# Altium schematic sheet STM32_M95.SchDoc
size C
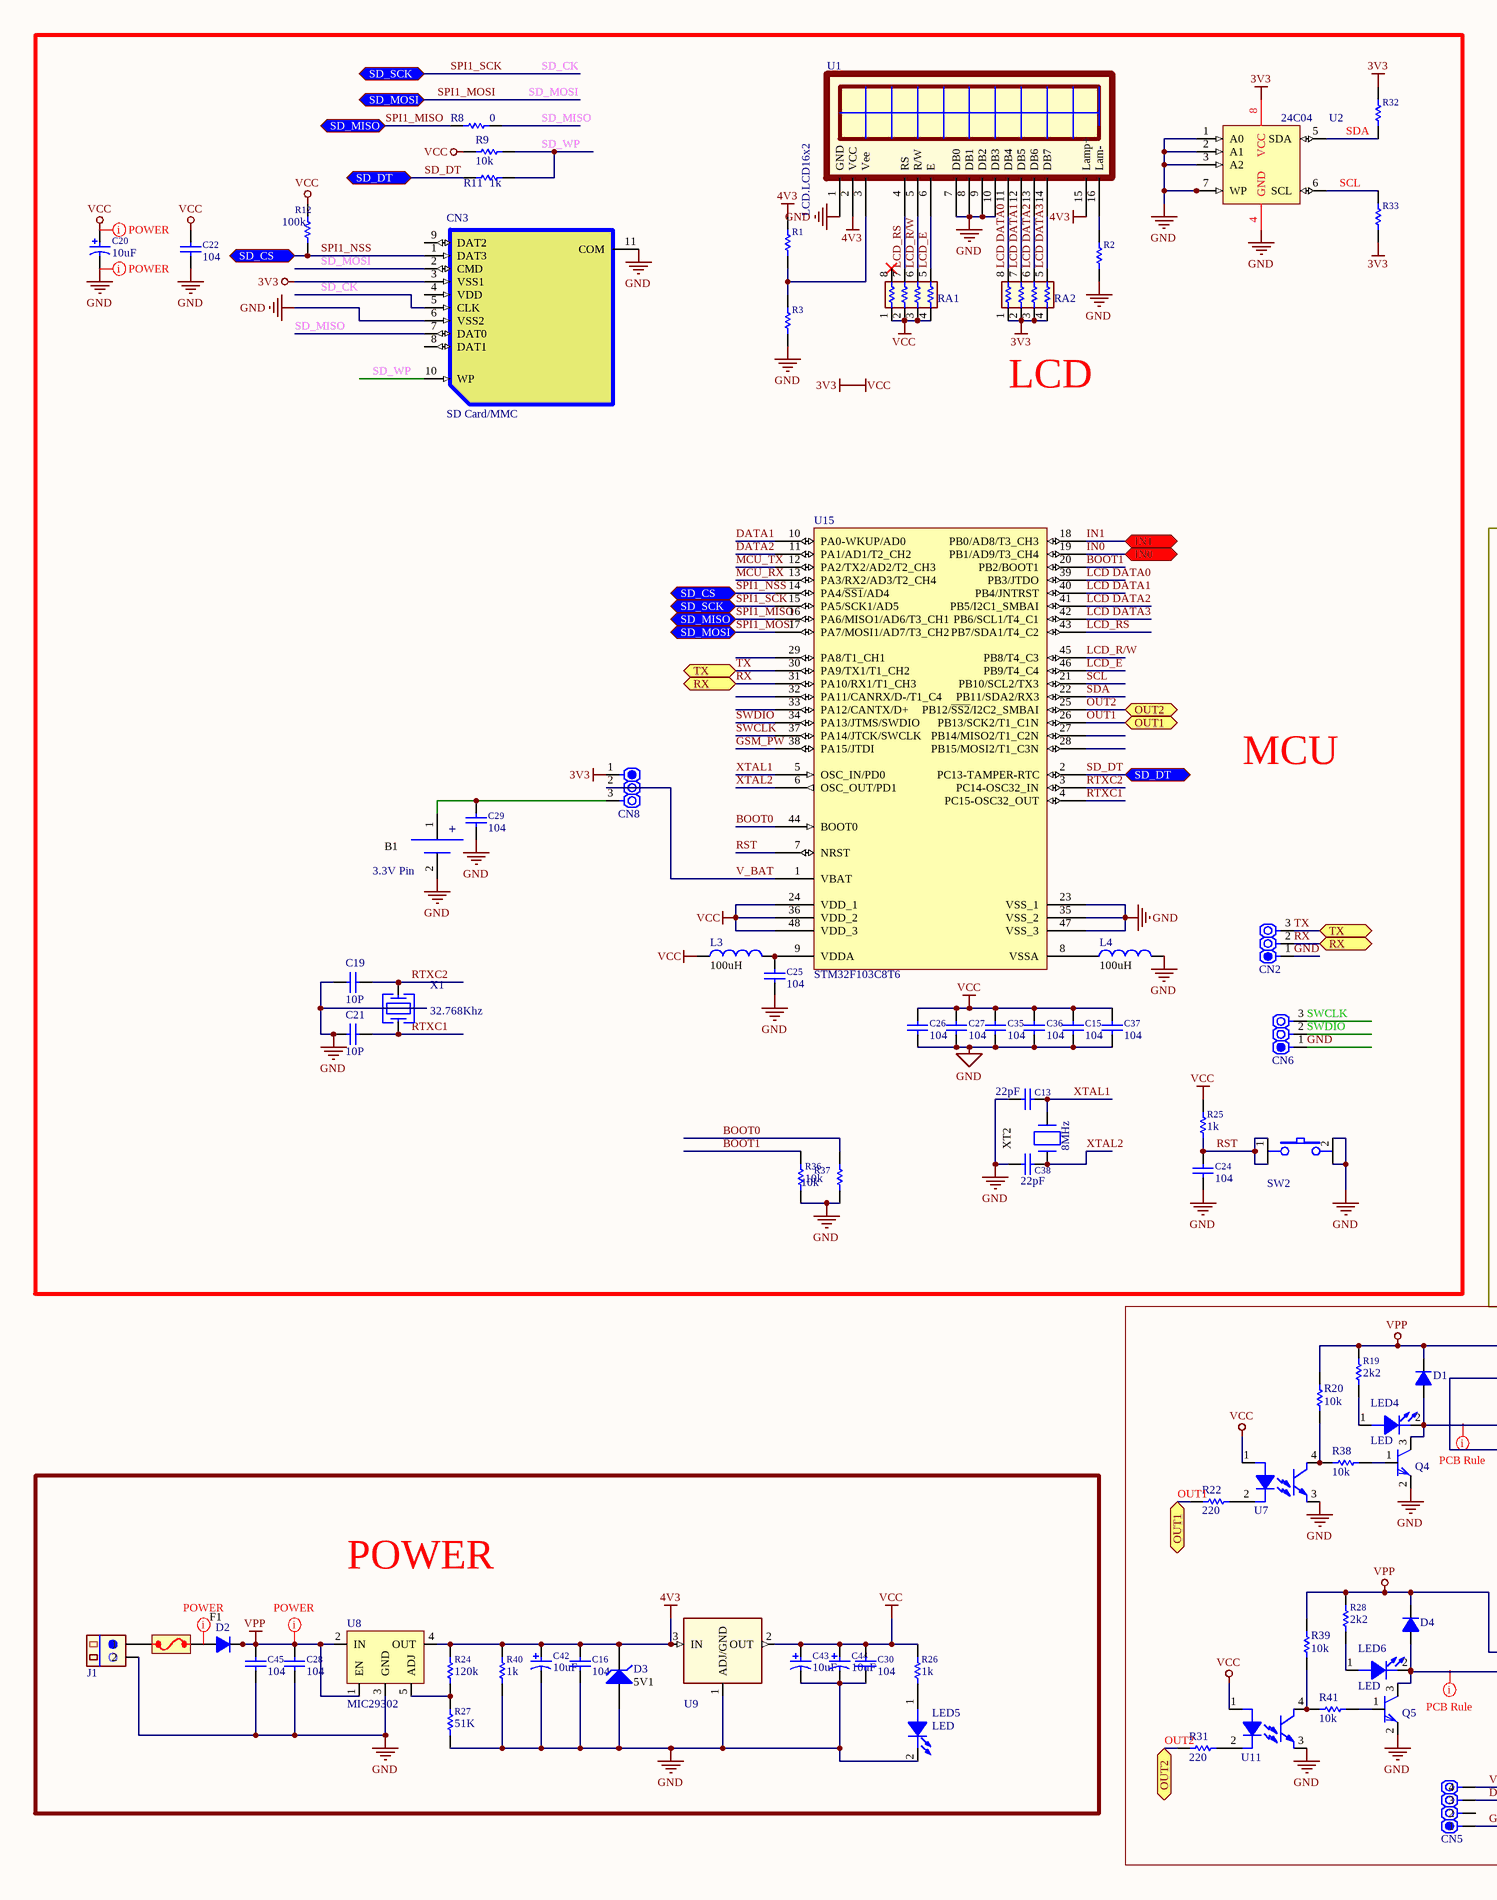
[diagram p0: STM32_M95.SchDoc, left]
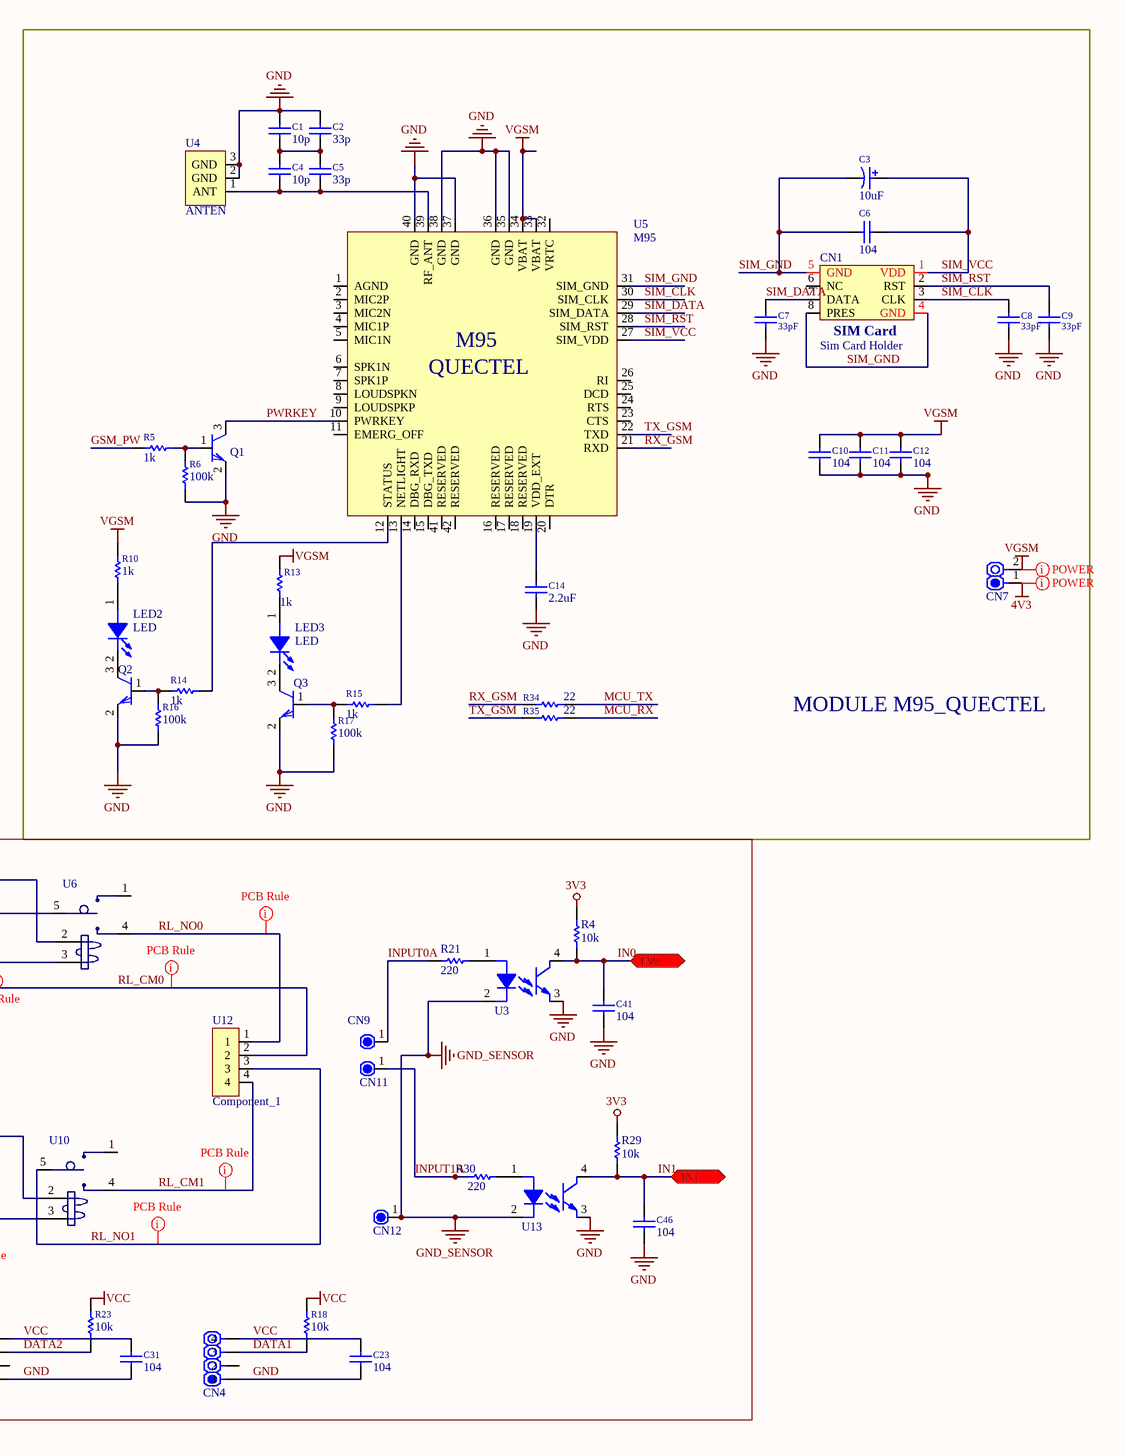
[diagram p1: STM32_M95.SchDoc, right]

## Parts
B1  value 3.3V Pin  [Batt_small]  (hidden comment: BATT-Holder)
C1  10p  [C2012-0805]
C2  33p  [C2012-0805]
C3  10uF  [Cap SMD Tant 10u]
C4  10p  [C2012-0805]
C5  33p  [C2012-0805]
C6  104  [C1608-0603]
C7  33pF  [C1608-0603]
C8  33pF  [C1608-0603]
C9  33pF  [C1608-0603]
C10  104  [C2012-0805]
C11  104  [C2012-0805]
C12  104  [C2012-0805]
C13  22pF  [C2012-0805]
C14  2.2uF  [C1206]
C15  104  [C2012-0805]
C16  104  [C1608-0603]
C19  10P  [C2012-0805]
C20  10uF  [Cap SMD Tant 10u]
C21  10P  [C2012-0805]
C22  104  [C2012-0805]
C23  104  [C1608-0603]
C24  104  [C2012-0805]
C25  104  [C2012-0805]
C26  104  [C2012-0805]
C27  104  [C2012-0805]
C28  104  [C1608-0603]
C29  104  [R1608-0603]
C30  104  [C1608-0603]
C31  104  [C1608-0603]
C35  104  [C2012-0805]
C36  104  [C2012-0805]
C37  104  [C2012-0805]
C38  22pF  [C2012-0805]
C41  104  [C1608-0603]
C42  10uF  [Cap SMD Tant - 470u]
C43  10uF  [Cap SMD Tant 10u]
C44  10uF  [Cap SMD Tant 10u]
C45  104  [C1210]
C46  104  [C1608-0603]
CN1  Sim Card Holder  [Sim card holder 1]
CN2  HDR1x3  [CON.HDR1X3]  (value not drawn)
CN3  SD Card/MMC  [mini_SDCard]
CN4  HDR1x4  [CON.HDR1X4]  (value not drawn)
CN5  HDR1x4  [CON.HDR1X4]  (value not drawn)
CN6  HDR1x3  [CON.HDR1X3]  (value not drawn)
CN7  HDR1x2  [CON.HDR1X2]  (value not drawn)
CN8  HDR1x3  [CON.HDR1X3]  (value not drawn)
CN9  HDR1  [CON.HDR1]  (value not drawn)
CN11  HDR1  [CON.HDR1]  (value not drawn)
CN12  HDR1  [CON.HDR1]  (value not drawn)
D1  FR307  [FR307]  (value not drawn)
D2  1N4007  [DO-214AA,SMB]  (value not drawn)
D3  value 5V1  [D1208]  (hidden comment: Zener)
D4  FR307  [FR307]  (value not drawn)
F1  FUSE  [FUSE.SMD2010]  (value not drawn)
J1  Domino2  [Domino 2 - Thao roi]  (value not drawn)
L3  100uH  [L2012-0805]
L4  100uH  [L2012-0805]
LED2  LED  [LED.SMD0805]
LED3  LED  [LED.SMD0805]
LED4  LED  [LED.SMD0805]
LED5  LED  [LED.SMD0805]
LED6  LED  [LED.SMD0805]
Q1  C1815  [SOT23 [C1815]]  (value not drawn)
Q2  C1815  [SOT23 [C1815]]  (value not drawn)
Q3  C1815  [SOT23 [C1815]]  (value not drawn)
Q4  C1815  [SOT23 [C1815]]  (value not drawn)
Q5  C1815  [SOT23 [C1815]]  (value not drawn)
R1  (no value)  [R2012-0805]
R2  (no value)  [R2012-0805]
R3  (no value)  [R2012-0805]
R4  10k  [R1608-0603]
R5  1k  [R1608-0603]
R6  100k  [R1608-0603]
R8  0  [R2012-0805]
R9  10k  [R2012-0805]
R10  1k  [R1608-0603]
R11  1k  [R2012-0805]
R12  100k  [R2012-0805]
R13  1k  [R1608-0603]
R14  1k  [R1608-0603]
R15  1k  [R1608-0603]
R16  100k  [R1608-0603]
R17  100k  [R1608-0603]
R18  10k  [R2012-0805]
R19  2k2  [R2012-0805]
R20  10k  [R1608-0603]
R21  220  [R1608-0603]
R22  220  [R2012-0805]
R23  10k  [R2012-0805]
R24  120k  [R1608-0603]
R25  1k  [R2012-0805]
R26  1k  [R1608-0603]
R27  51K  [R1608-0603]
R28  2k2  [R2012-0805]
R29  10k  [R1608-0603]
R30  220  [R1608-0603]
R31  220  [R2012-0805]
R32  (no value)  [R2012-0805]
R33  (no value)  [R2012-0805]
R34  22  [R1608-0603]
R35  22  [R1608-0603]
R36  10k  [R1608-0603]
R37  10k  [R1608-0603]
R38  10k  [R1608-0603]
R39  10k  [R1608-0603]
R40  1k  [R1608-0603]
R41  10k  [R1608-0603]
RA1  10,100,1K,10K  [Res_Array_Chip]  (value not drawn)
RA2  10,100,1K,10K  [Res_Array_Chip]  (value not drawn)
SW2  SW TACT-SPST-2  [BUTTON_RIGHT_ANGLE]  (value not drawn)
U1  LCD.LCD16x2  [LCD connector]
U2  24C04  [SOIC8]
U3  PC817  [DIP4]  (value not drawn)
U4  ANTEN  [SOT150P320X110-3N]
U5  M95  [QFN50P400X400X80_HS-15N]
U6  RELAY_OMRON_4PIN  [PCBComponent_1]  (value not drawn)
U7  PC817  [DIP4]  (value not drawn)
U8  MIC29302  [DPAK165P1524X238-5N]
U9  LM1117-3.3V  [TO-252]  (value not drawn)
U10  RELAY_OMRON_4PIN  [PCBComponent_1]  (value not drawn)
U11  PC817  [DIP4]  (value not drawn)
U12  Component_1  [PCBComponent_1]
U13  PC817  [DIP4]  (value not drawn)
U15  STM32F103C8T6  [QFP48_pitch_0.5mm]
X1  32.768Khz  [Crystal cylinder]
XT2  8MHz  [QC49/SMD]

## Blocks framed on the sheet
MODULE M95_QUECTEL: C1-C12 C14 CN1 CN7 LED2 LED3 Q1-Q3 R5 R6 R10 R13-R17 R34 R35 U4 U5
POWER: C16 C28 C30 C42-C45 D2 D3 F1 J1 LED5 R24 R26 R27 R40 U8 U9

## Ports
IN0, IN1, OUT1, OUT2, RX, SD_CS, SD_DT, SD_MISO, SD_MOSI, SD_SCK, TX

## Nets
4V3: C16.1 C42.1 CN7.1 D3.2(K) R1.1 R24.1 R40.1 U1.2(VCC) U1.15(Lamp+) U8.4(OUT) U9.3(IN)
GND: B1.2(-) C1.1 C2.1 C7.2 C8.2 C9.2 C10.2 C11.2 C12.2 C13.1 C14.2 C15.2 C16.2 C19.1 C20.2 C21.1 C22.2 C23.2 C24.2 C25.2 C26.2 C27.2 C28.2 C29.2 C30.2 C31.2 C35.2 C36.2 C37.2 C38.1 C41.2 C42.2 C43.2 C44.2 C45.2 C46.2 CN2.1 CN3.6(VSS2) CN3.11(COM) CN4.1 CN5.1 CN6.1 D3.1(A) J1.2 L4.2 LED5.2(K) Q1.2(E) Q2.2(E) Q3.2(E) Q4.2(E) Q5.2(E) R2.2 R3.2 R6.1 R16.1 R17.2 R27.2 R36.2 R37.2 R40.2 SW2.2 U1.1(GND) U1.7(DB0) U1.8(DB1) U1.9(DB2) U1.10(DB3) U2.1(A0) U2.2(A1) U2.3(A2) U2.4(GND) U2.7(WP) U3.3 U4.2(GND) U4.3(GND) U5.35(GND) U5.36(GND) U5.37(GND) U5.38(GND) U5.40(GND) U7.3 U8.3(GND) U9.1(ADJ/GND) U11.3 U13.3 U15.23(VSS_1) U15.35(VSS_2) U15.47(VSS_3) X1.3(GND)
GND_SENSOR: CN12.1 U3.2 U13.2
VCC: C15.1 C20.1 C22.1 C23.1 C26.1 C27.1 C30.1 C31.1 C35.1 C36.1 C37.1 C43.1 C44.1 CN3.3(VSS1) CN4.4 CN5.4 CN8.1 L3.1 R4.2 R9.1 R12.1 R18.1 R23.1 R25.1 R26.1 R29.2 R32.1 R33.2 RA1.1 RA1.2 RA1.3 RA1.4 RA2.1 RA2.2 RA2.3 RA2.4 U2.8(VCC) U7.1 U9.2(OUT) U11.1 U15.24(VDD_1) U15.36(VDD_2) U15.48(VDD_3)  [also labelled 3V3]
VGSM: C10.1 C11.1 C12.1 CN7.2 R10.1 R13.1 U5.33(VBAT) U5.34(VBAT)
VPP: C28.1 C45.1 D1.2(K) D2.2(K) D4.2(K) R19.1 R20.2 R28.1 R39.2 U6.2 U8.1(EN) U8.2(IN) U10.2
BOOT0: R37.1 U15.44(BOOT0)
BOOT1: R36.1 U15.20(PB2/BOOT1)
DATA1: CN4.3 R18.2 U15.10(PA0-WKUP/AD0)
DATA2: CN5.3 R23.2 U15.11(PA1/AD1/T2_CH2)
GSM_PW: R5.1 U15.38(PA15/JTDI)
IN0: C41.1 R4.1 U3.4 U15.19(PB1/AD9/T3_CH4) ; port IN0
IN1: C46.1 R29.1 U13.4 U15.18(PB0/AD8/T3_CH3) ; port IN1
INPUT0A: CN9.1 R21.1
INPUT1A: CN11.1 R30.1
LCD DATA0: RA2.8 U1.11(DB4) U15.39(PB3/JTDO)
LCD DATA1: RA2.7 U1.12(DB5) U15.40(PB4/JNTRST)
LCD DATA2: RA2.6 U1.13(DB6) U15.41(PB5/I2C1_SMBAI)
LCD DATA3: RA2.5 U1.14(DB7) U15.42(PB6/SCL1/T4_C1)
LCD_E: RA1.5 U1.6(E) U15.46(PB9/T4_C4)
LCD_R/W: RA1.6 U1.5(R/W) U15.45(PB8/T4_C3)
LCD_RS: RA1.7 U1.4(RS) U15.43(PB7/SDA1/T4_C2)
MCU_RX: R35.2 U15.13(PA3/RX2/AD3/T2_CH4)
MCU_TX: R34.2 U15.12(PA2/TX2/AD2/T2_CH3)
OUT1: R22.1 U15.26(PB13/SCK2/T1_C1N) ; port OUT1
OUT2: R31.1 U15.25(PB12/~{SS2}/I2C2_SMBAI) ; port OUT2
PWRKEY: Q1.3(C) U5.10(PWRKEY)
RL_CM0: U6.5 U12.2
RL_CM1: U10.4 U12.4
RL_NO0: U6.4 U12.1
RL_NO1: U10.5 U12.3
RST: C24.1 R25.2 SW2.1 U15.7(NRST)
RTXC1: C21.2 U15.4(PC15-OSC32_OUT) X1.2
RTXC2: C19.2 U15.3(PC14-OSC32_IN) X1.1
RX: CN2.2 U15.31(PA10/RX1/T1_CH3) ; port RX
RX_GSM: R34.1 U5.21(RXD)
SCL: R33.1 U2.6(SCL) U15.21(PB10/SCL2/TX3)
SD_CK: CN3.5(CLK) U15.15(PA5/SCK1/AD5) ; port SD_SCK  [also labelled SPI1_SCK]
SD_DT: R11.1 U15.2(PC13-TAMPER-RTC) ; port SD_DT
SD_MISO: CN3.7(DAT0) R8.2
SD_MOSI: CN3.2(CMD) U15.17(PA7/MOSI1/AD7/T3_CH2) ; port SD_MOSI  [also labelled SPI1_MOSI]
SD_WP: CN3.10(WP) R9.2 R11.2
SDA: R32.2 U2.5(SDA) U15.22(PB11/SDA2/RX3)
SIM_CLK: C8.1 CN1.3(CLK) U5.30(SIM_CLK)
SIM_DATA: C7.1 CN1.7(DATA) U5.29(SIM_DATA)
SIM_GND: C3.2 C6.1 CN1.4(GND) CN1.5(GND) CN1.8(PRES) U5.31(SIM_GND)
SIM_RST: C9.1 CN1.2(RST) U5.28(SIM_RST)
SIM_VCC: C3.1 C6.2 CN1.1(VDD) U5.27(SIM_VDD)
SPI1_MISO: R8.1 U15.16(PA6/MISO1/AD6/T3_CH1) ; port SD_MISO
SPI1_NSS: CN3.1(DAT3) R12.2 U15.14(PA4/~{SS1}/AD4) ; port SD_CS
SWCLK: CN6.3 U15.37(PA14/JTCK/SWCLK)
SWDIO: CN6.2 U15.34(PA13/JTMS/SWDIO)
TX: CN2.3 U15.30(PA9/TX1/T1_CH2) ; port TX
TX_GSM: R35.1 U5.22(TXD)
V_BAT: CN8.2 U15.1(VBAT)
XTAL1: C13.2 U15.5(OSC_IN/PD0) XT2.2
XTAL2: C38.2 U15.6(OSC_OUT/PD1) XT2.1
NetB1_1: B1.1(+) C29.1 CN8.3
NetC1_2: C1.2 C2.2 C4.1 C5.1
NetC4_2: C4.2 C5.2 U4.1(ANT) U5.39(RF_ANT)
NetC14_1: C14.1 U5.19(VDD_EXT)
NetC25_1: C25.1 L3.2 U15.9(VDDA)
NetD1_1: D1.1(A) LED4.2(K) Q4.3(C) U6.3
NetD2_1: D2.1(A) F1.2
NetD4_1: D4.1(A) LED6.2(K) Q5.3(C) U10.3
NetF1_1: F1.1 J1.1
NetL4_1: L4.1 U15.8(VSSA)
NetLED2_1: LED2.1(A) R10.2
NetLED2_2: LED2.2(K) Q2.3(C)
NetLED3_1: LED3.1(A) R13.2
NetLED3_2: LED3.2(K) Q3.3(C)
NetLED4_1: LED4.1(A) R19.2
NetLED5_1: LED5.1(A) R26.2
NetLED6_1: LED6.1(A) R28.2
NetQ1_1: Q1.1(B) R5.2 R6.2
NetQ2_1: Q2.1(B) R14.1 R16.2
NetQ3_1: Q3.1(B) R15.2 R17.1
NetQ4_1: Q4.1(B) R38.1
NetQ5_1: Q5.1(B) R41.1
NetR1_2: R1.2 R3.1 U1.3(Vee)
NetR2_1: R2.1 U1.16(Lam-)
NetR14_2: R14.2 U5.12(STATUS)
NetR15_1: R15.1 U5.13(NETLIGHT)
NetR20_1: R20.1 R38.2 U7.4
NetR21_2: R21.2 U3.1
NetR22_2: R22.2 U7.2
NetR24_2: R24.2 R27.1 U8.5(ADJ)
NetR30_2: R30.2 U13.1
NetR31_2: R31.2 U11.2
NetR39_1: R39.1 R41.2 U11.4

Not connected (* = marked no-connect by the designer): CN1 6(NC); CN3 4(VDD) 8(DAT1) 9(DAT2); CN4 2; CN5 2; RA1 8*; U5 1(AGND) 2(MIC2P) 3(MIC2N) 4(MIC1P) 5(MIC1N) 6(SPK1N) 7(SPK1P) 8(LOUDSPKN) 9(LOUDSPKP) 11(EMERG_OFF) 14(DBG_RXD) 15(DBG_TXD) 16(RESERVED) 17(RESERVED) 18(RESERVED) 20(DTR) 23(CTS) 24(RTS) 25(DCD) 26(RI) 32(VRTC) 41(RESERVED) 42(RESERVED); U6 1; U10 1; U15 27(PB14/MISO2/T1_C2N) 28(PB15/MOSI2/T1_C3N) 29(PA8/T1_CH1) 32(PA11/CANRX/D-/T1_C4) 33(PA12/CANTX/D+)

## Layout directives
rule Width Constraint [Pref Width = 90mil    Min Width = 80mil    Max Width = 90mil]: RL_CM0, RL_CM1, RL_NO0, RL_NO1
rule Width Constraint [Pref Width = 40mil    Min Width = 30mil    Max Width = 50mil]: (no net found under the mark)
: POWER; rule Width Constraint [Pref Width = 30mil    Min Width = 10mil    Max Width = 40mil]: 4V3, GND, NetD2_1, VCC, VGSM, VPP

## Notes on the sheet
- (near RA2) LCD
- MCU
- (in symbol Component_1) QUECTEL
- (in symbol Sim Card Holder) SIM Card

## Library data of the parts
B1 = BATT-Holder: Battery holder; Manufacturer: China; Vendor: Digikey; Published: 13-April-2009; ComponentLink1Description: Digikey Part Link; ComponentLink2Description: Open Datasheet; ComponentLink2URL: H:\LIBRARY\LIBRARY.Datasheet\; Price: 3000 VND; Date of Price: 19/11/2010; Part: BATT-Holder
C1 C2 C4 C5 C7-C9 C13 C14 C19 C21 C38 = Capacitor: Cap, Ceramic Capacitor, 104, 10V; Part: 104; AEMS Code: 2100341; Vendor: TMe; Voltage: 16V; Published: 13-April-2009; ComponentLink1Description: Digikey Part Link; ComponentLink2Description: Open Datasheet; ComponentLink2URL: H:\LIBRARY\LIBRARY.Datasheet\; Price: 600 VND; Date of Price: 19/11/2010
  C1 C4: Value: 10p
  C2 C5: Value: 33p
  C13 C38: Value: 22pF
  C14: Value: 2.2uF
  C19 C21: Value: 10P
C3 C20 C42-C44 = Cap_Pol: Cap, Polizared Capacitor 10uF,16V; Manufacturer: FARNELL; AEMS Code: 2100110; Vendor: TMe; Cap Type: Alu Solid; Type: Aluminum Solid/Tantalum Capacitor; Published: 13-April-2009; ComponentLink1Description: Digikey Part Link; ComponentLink2Description: Open Datasheet; ComponentLink2URL: H:\LIBRARY\LIBRARY.Datasheet\; Price: 1600 VND; Voltage: 16V; Date of Price: 19/11/2010; Part: 10uF; Value: 10uF
C6 C10-C12 C15 C16 C22-C31 C35-C37 C41 C45 C46 = Capacitor: Cap, Ceramic Capacitor, 104, 10V; AEMS Code: 2100341; Vendor: TMe; Voltage: 16V; Published: 13-April-2009; ComponentLink1Description: Digikey Part Link; ComponentLink2Description: Open Datasheet; ComponentLink2URL: H:\LIBRARY\LIBRARY.Datasheet\; Price: 600 VND; Date of Price: 19/11/2010; Part: 104; Value: 104
CN1 = Sim Card Holder: Vendor: RP; ComponentLink2Description: Open DataSheet; ComponentLink2URL: H:\LIBRARY\LIBRARY.Datasheet\; Date of Price: 19/11/2010; Price: 40000 VND
CN2 CN6 CN8 = HDR1x3: Conn, Header 1x3; Vendor: Nhat Tao; ComponentLink1Description: Digikey Part link; ComponentLink2Description: Open DataSheet; ComponentLink2URL: H:\LIBRARY\LIBRARY.Datasheet\; Date of Price: 19/11/2010; Price: 500 VND
CN3 = SD Card/MMC: MMC/SD Card; ComponentLink2Description: Open DataSheet; ComponentLink2URL: H:\LIBRARY\LIBRARY.Datasheet\; Date of Price: 19/11/2010; Price: 5000 VND
CN4 CN5 = HDR1x4: Conn, Header 1x4; Vendor: Nhat Tao; ComponentLink1Description: Digikey Part link; ComponentLink2Description: Open DataSheet; ComponentLink2URL: H:\LIBRARY\LIBRARY.Datasheet\; Date of Price: 19/11/2010; Price: 500 VND
CN7 = HDR1x2: Conn, Header 1x2; Vendor: Nhat Tao; ComponentLink1Description: Digikey Part link; ComponentLink2Description: Open DataSheet; ComponentLink2URL: H:\LIBRARY\LIBRARY.Datasheet\; Date of Price: 19/11/2010; Price: 500 VND
CN9 CN11 CN12 = HDR1: Conn, Header 1; Vendor: Nhat Tao; ComponentLink1Description: Digikey Part link; ComponentLink2Description: Open DataSheet; ComponentLink2URL: H:\LIBRARY\LIBRARY.Datasheet\; Date of Price: 19/11/2010; Price: 500 VND
D1 D4 = Diode FR307: Diode, Fast Recovery, 3A FR307; Vendor: Nhat Tao 158B Ly Thuong Kiet; Current: 3Amp; Published: 8-Jun-2000; LatestRevisionDate: 17-Jul-2002; LatestRevisionNote: Re-released for DXP Platform.; PackageReference: DO-35; Code_JEDEC: DO-204-AH; ComponentLink1Description: Digikey Part Link; ComponentLink1URL: http://www.fairchildsemi.com/; ComponentLink2Description: Open Datasheet; ComponentLink2URL: H:\LIBRARY\LIBRARY.Datasheet\ds26003.pdf; Value: FR307; Price: 2000 VND; Date of Price: 19/11/2010; Part: Diode FR307
D2 = Diode 1N4007: Diode, General Purpose Rectifier, 1Amp,1000V 1N4007; Vendor: Nhat Tao; Published: 8-Jun-2000; LatestRevisionDate: 17-Jul-2002; LatestRevisionNote: Re-released for DXP Platform.; PackageReference: DO-35; Code_JEDEC: DO-204-AH; ComponentLink1Description: Digikey Part Link; ComponentLink1URL: http://www.fairchildsemi.com/; ComponentLink2Description: Open Datasheet; ComponentLink2URL: http://www.fairchildsemi.com/ds/1N%2F1N4448.pdf; Value: 1N4007; Current: 1Amp; Price: 500 VND; Date of Price: 19/11/2010; Part: Diode 1N4007
D3 = Diode Zener: Diode, Zener; Vendor: Digikey; Voltage: 5.1V; Published: 8-Jun-2000; LatestRevisionDate: 17-Jul-2002; LatestRevisionNote: Re-released for DXP Platform.; PackageReference: DIODE-0.7; ComponentLink1Description: Digikey Part Link; ComponentLink2Description: Open Datasheet; ComponentLink2URL: H:\LIBRARY\LIBRARY.Datasheet\; Price: 1000 VND; Date of Price: 19/11/2010; Part: Diode Zener
F1 = FUSE: Value: Fuse 5A/220V; Vendor: Digikey; Published: 13-April-2009; ComponentLink1Description: Digikey Part Link; ComponentLink2Description: Open Datasheet; ComponentLink2URL: H:\LIBRARY\LIBRARY.Datasheet\; Price: 3000 VND; Date of Price: 19/11/2010; Part: FUSE
J1 = Domino2: Conn, 2 pins Domino Header; ComponentLink1Description: Digikey Part link; ComponentLink2Description: Open DataSheet; ComponentLink2URL: H:\LIBRARY\LIBRARY.Datasheet\; Price: 2000VND; Date of Price: 19/11/2010
L3 L4 = Inductor: Ind, 100uH, 20%; Code_IEC: 1005; Vendor: Nhat Tao Ong Thuan; Published: 8-Jun-2000; LatestRevisionDate: 17-Jul-2002; LatestRevisionNote: Re-released for DXP Platform.; PackageReference: 0402-A; Code_JEITA: 0402; ComponentLink1Description: Digikey Part Link; ComponentLink2Description: Open Datasheet; ComponentLink2URL: H:\LIBRARY\LIBRARY.Datasheet\; Price: 4000 VND; Date of Price: 19/11/2010; Part: Inductor; Value: 100uH
LED2-LED6 = LED: Led, Red, SMD0805; Manufacturer: Lite-On Inc; Vendor: Chip Le Tran/RP; Value: Red Led; Price: 1000 VND; Published: 13-April-2009; ComponentLink1Description: Digikey Part Link; ComponentLink2Description: Open Datasheet; ComponentLink2URL: H:\LIBRARY\LIBRARY.Datasheet\; Date of Price: 19/11/2010; Part: LED
Q1-Q5 = C1815: BJT, Audio Freq Amplifier NPN Transistor C1815; Vendor: TMe; Published: 13-April-2009; ComponentLink1Description: Digikey Part Link; ComponentLink2Description: Open Datasheet; ComponentLink2URL: H:\LIBRARY\LIBRARY.Datasheet\; Price: 800VND; Date of Price: 19/8/2010; Part: C1815; Value: C1815
R1-R6 R10 R13-R41 = Resistor: Res, 1K,1/10W, 0805, 10%; AEMS Code: 1200430; Vendor: TMe; Tollerance: 5%; Published: 17-3-2009; ComponentLink1Description: Digikey Part Link; ComponentLink2Description: Open Datasheet; ComponentLink2URL: H:\LIBRARY\LIBRARY.Datasheet\; Price: 50 VND; Date of Price: 19/11/2010; Part: Resistor
  R4 R18 R20 R23 R29 R36-R39 R41: Value: 10k
  R5 R10 R13-R15 R25 R26 R40: Value: 1k
  R6 R16 R17: Value: 100k
  R19 R28: Value: 2k2
  R21 R22 R30 R31: Value: 220
  R24: Value: 120k
  R27: Value: 51K
  R34 R35: Value: 22
R8 R9 R11 = Resistor: Res, 1K,1/10W, 0805, 10%; AEMS Code: 1200430; Vendor: TMe; Published: 17-3-2009; ComponentLink1Description: Digikey Part Link; ComponentLink2Description: Open Datasheet; ComponentLink2URL: H:\LIBRARY\LIBRARY.Datasheet\; Date of Price: 19/11/2010; Part: Resistor; Price: 50 VND
  R8: Value: 0
  R9: Value: 10k
  R11: Value: 1k
R12 = Resistor: AEMS Code: 1200430; Vendor: Digikey; Published: 17-3-2009; Publisher: Hoang Nguyen; ComponentLink1Description: Digikey Part Link; ComponentLink2Description: Open Datasheet; ComponentLink2URL: H:\LIBRARY\LIBRARY.Datasheet\; Value: 100k
RA1 RA2 = Resister Array Chip 4xR: Res Array Chip,10%; Manufacturer: Yageo; Manufacturer P/N: YC164J; Vendor: Bang Dat; Published: 13-April-2009; ComponentLink1Description: Digikey Part Link; ComponentLink2Description: Open Datasheet; Value: 10,100,1K,10K; ComponentLink2URL: H:\LIBRARY\LIBRARY.Datasheet\; Price: 1500 VND; Date of Price: 19/11/2010; Part: Resister Array Chip 4xR
SW2 = SW PUSHBUTTON-SPST-2/SM: Switch, TACT-SPST-2; Vendor: Nhat Tao Ong Thuan; Published: 13-April-2009; ComponentLink1Description: Digikey Part Link; ComponentLink2Description: Open Datasheet; ComponentLink2URL: H:\LIBRARY\LIBRARY.Datasheet\; Price: 1000VND; Date of Price: 19/11/2010; Part: SW TACT-SPST-2; Value: SWitch
U1 = LCD.LCD16x2: LCD, 2 line 16 charactors; Vendor: TMe; Value: LCD 2x16; Published: 13-April-2009; ComponentLink1Description: Digikey Part Link; ComponentLink2Description: Open Datasheet; ComponentLink2URL: H:\LIBRARY\LIBRARY.Datasheet\; Price: 80000VND; Date of Price: 19/11/2010; Part: LCD.LCD16x2
U2 = 24LC04: IC, 2-wire Serial EEPROM 512K 24C04; Manufacturer: Atmel; Value: 512Kb; Vendor: TMe; ComponentLink2Description: Open datasheet; ComponentLink2URL: H:\LIBRARY\LIBRARY.Datasheet\24c512.pdf; Price: 6000 VND; Date of Price: 19/11/2010; Part: 24LC04
U3 U7 U11 U13 = PC817: Opto, High Density Opto-Coupler PC817; Vendor: Nhat Tao - IC Thuan; Fc: 80Khz; Published: 13-April-2009; ComponentLink1Description: Digikey Part Link; ComponentLink2Description: Open Datasheet; ComponentLink2URL: H:\LIBRARY\LIBRARY.Datasheet\ds_PC817.pdf; Price: 2000 VND; Date of Price: 19/11/2010; Part: PC817; Value: PC817
U4-U6 U8 U10 = Component_1
U9 = LM1117MP-3.3TR: IC, 3.3V 800mA Low-Dropout Linear Regulator LM1117-3.3V; Vendor: Digikey; Volt (Max): 20V; Value: LM1117MP-3V3; ComponentLink1URL: http://search.digikey.com/scripts/DkSearch/dksus.dll?Detail&name=LM1117MP-3.3TR-ND; ComponentLink1Description: Digikey Part Link; ComponentLink2Description: Open Datasheet; ComponentLink2URL: H:\LIBRARY\LIBRARY.Datasheet\LM1117.pdf; Published: 13-April-2009; V out: 3.3V; Output Current (max): 800mA; Price: 4000 VND; Date of Price: 19/11/2010; Part: LM1117MP-3.3TR
U15 = STM32F103C8T6: STM32 ARM-based 32-bit MCU with 64 Kbytes Flash, 48-pin LQFP, Industrial Temperature; Published: 30-May-2008; DatasheetVersion: rev6, Mar-2008; PackageVersion: Mar-2008; PackageReference: LQFP48; Publisher: Altium Limited; PackageDescription: 48-Pin Low-Profile Quad Flat Pack, 7 x 7 mm Body, 0.5 mm Pitch (LQFP48); ComponentLink1Description: Manufacturer Link; ComponentLink1URL: www.st.com/stm32; ComponentLink2Description: Datasheet; ComponentLink2URL: http://www.st.com/stonline/products/literature/ds/13587.pdf
X1 = Xtal 1: Osc, 32.768Khz, Tuning Forl Crystal Units (SMD-Cylinder Type); Vendor: Nhat Tao 158B Ly Thuong Kiet; ComponentLink1URL: http://search.digikey.com/scripts/DkSearch/dksus.dll?Detail&name=300-2066-1-ND; ComponentLink1Description: Digikey Part Link; ComponentLink2URL: H:\LIBRARY\LIBRARY.Datasheet\k-cmr.pdf; ComponentLink2Description: Open Datasheet; Published: 13-April-2009; Price: 4000 VND; Date of Price: 19/8/2010; Value: 32.768Khz
XT2 = Xtal 2: Osc, 4Mhz Crystal; Vendor: Nhat Tao 158B Ly Thuong Kiet; Published: 13-April-2009; ComponentLink1Description: Digikey Part Link; ComponentLink2Description: Open Datasheet; ComponentLink2URL: H:\LIBRARY\LIBRARY.Datasheet\; Price: 4000 VND; Date of Price: 19/8/2010; Part: 4Mhz; Value: 8MHz